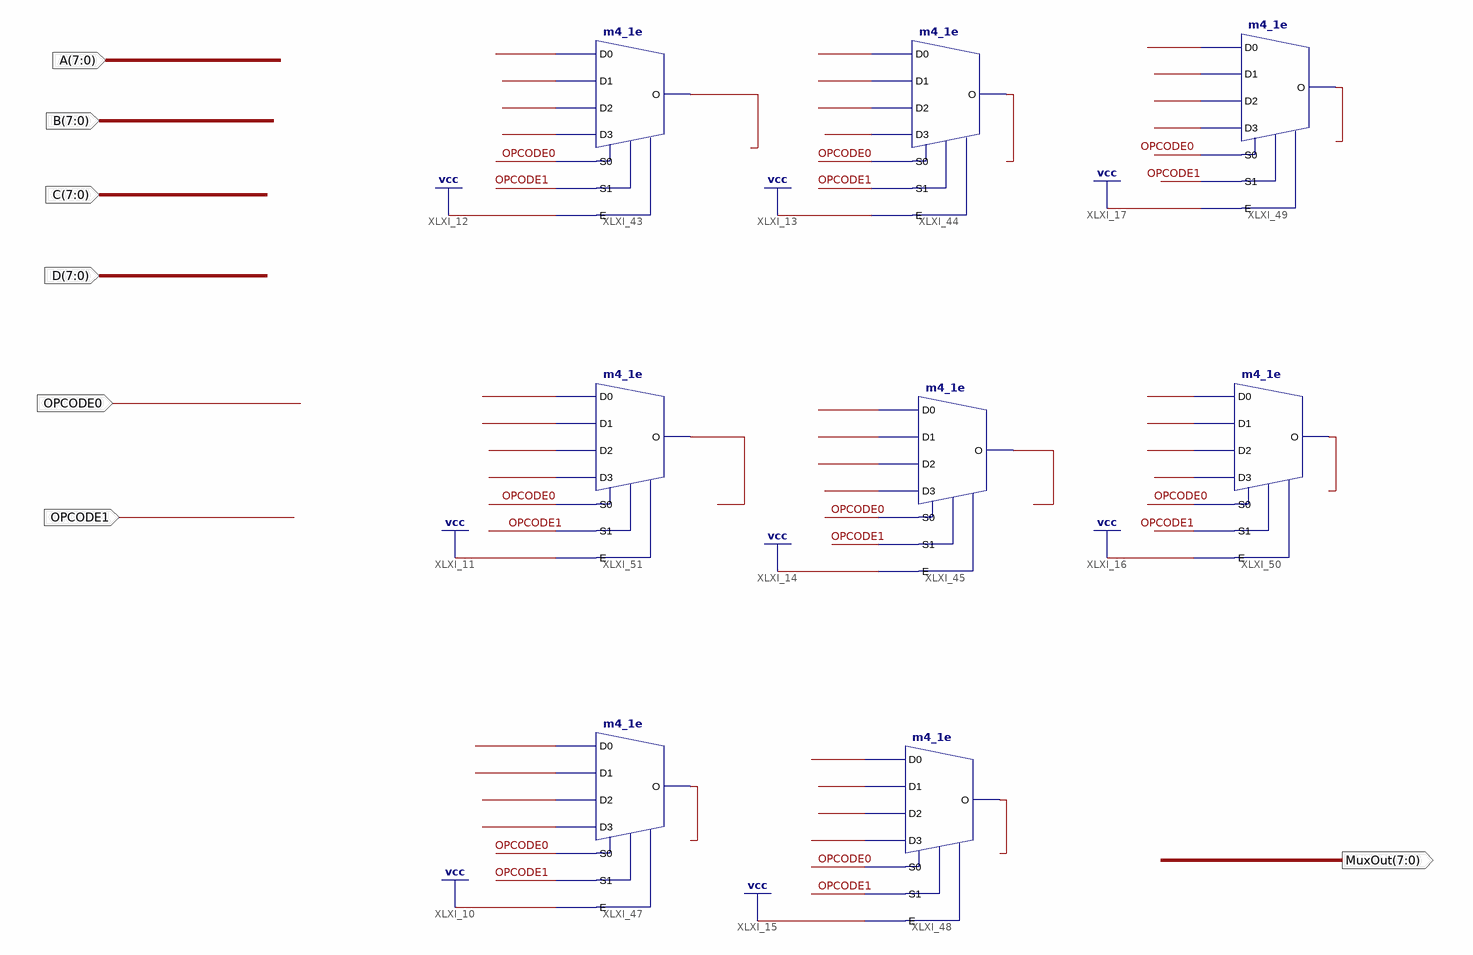
[diagram p0: schematic sheet 1]
// Xilinx ISE schematic Mux4.sch (spartan6) as structural Verilog: 8 symbols, 7 ports
module Mux4 (
  input  OPCODE0,
  input  OPCODE1,
  input  [7:0] B,
  input  [7:0] A,
  input  [7:0] C,
  input  [7:0] D,
  output [7:0] MuxOut
);

  m4_1e XLXI_43 (.D0(A[0]), .D1(B[0]), .D2(C[0]), .D3(D[0]), .E(1'b1), .S0(OPCODE0), .S1(OPCODE1), .O(MuxOut[0]));
  m4_1e XLXI_47 (.D0(A[2]), .D1(B[2]), .D2(C[2]), .D3(D[2]), .E(1'b1), .S0(OPCODE0), .S1(OPCODE1), .O(MuxOut[2]));
  m4_1e XLXI_51 (.D0(A[1]), .D1(B[1]), .D2(C[1]), .D3(D[1]), .E(1'b1), .S0(OPCODE0), .S1(OPCODE1), .O(MuxOut[1]));
  m4_1e XLXI_49 (.D0(A[6]), .D1(B[6]), .D2(C[6]), .D3(D[6]), .E(1'b1), .S0(OPCODE0), .S1(OPCODE1), .O(MuxOut[6]));
  m4_1e XLXI_44 (.D0(A[3]), .D1(B[3]), .D2(C[3]), .D3(D[3]), .E(1'b1), .S0(OPCODE0), .S1(OPCODE1), .O(MuxOut[3]));
  m4_1e XLXI_50 (.D0(A[7]), .D1(B[7]), .D2(C[7]), .D3(D[7]), .E(1'b1), .S0(OPCODE0), .S1(OPCODE1), .O(MuxOut[7]));
  m4_1e XLXI_45 (.D0(A[4]), .D1(B[4]), .D2(C[4]), .D3(D[4]), .E(1'b1), .S0(OPCODE0), .S1(OPCODE1), .O(MuxOut[4]));
  m4_1e XLXI_48 (.D0(A[5]), .D1(B[5]), .D2(C[5]), .D3(D[5]), .E(1'b1), .S0(OPCODE0), .S1(OPCODE1), .O(MuxOut[5]));
endmodule
